# Altium project Main.PrjPcb
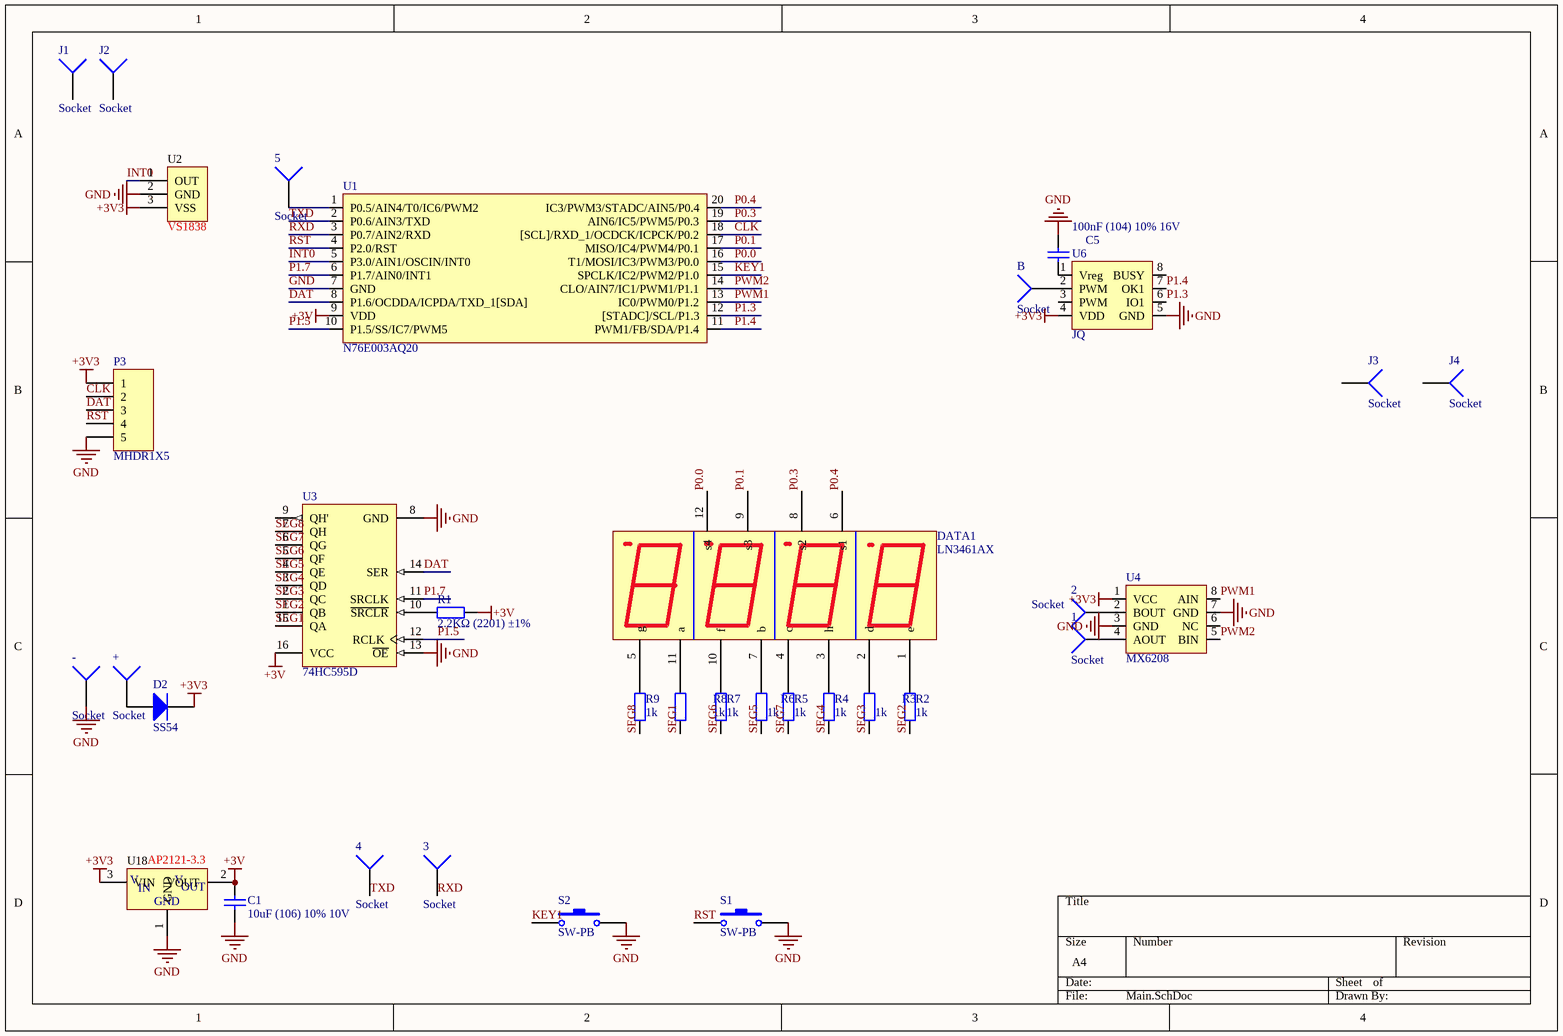
[diagram p0: Main.SchDoc]
10 sheets, 79 parts. Net scope: global (net labels, ports and power ports of the same name join across sheets).
Board file: Main.PcbDoc
Sheets:
  Main.SchDoc
  L0.SchDoc
  L1.SchDoc
  L6.SchDoc
  L4.SchDoc
  L7.SchDoc
  L3.SchDoc
  L5.SchDoc
  L2.SchDoc
  L8.SchDoc

## Sheet Main.SchDoc
size A4

### Parts
1  Socket  [MODULE-PAD$2F$3]
2  Socket  [MODULE-PAD$2F$3]
3  Socket  [MODULE-PAD$2F$3]
4  Socket  [MODULE-PAD$2F$3]
5  Socket  [MODULE-PAD$2F$3]
+  Socket  [MODULE-PAD$2F$3]
-  Socket  [MODULE-PAD$2F$3]
B  Socket  [MODULE-PAD$2F$3]
C1  10uF (106) 10% 10V  [0603_C]
C5  100nF (104) 10% 16V  [0402_C]
D2  SS54  [SMA(DO-214AC)_S1]
DATA1  LN3461AX  [DIP12:DISP2]
J1  Socket  [FPAD_1]
J2  Socket  [FPAD_1]
J3  Socket  [FPAD_1]
J4  Socket  [FPAD_1]
P3  MHDR1X5  [MHDR1X5]
R1  2.2KΩ (2201) ±1%  [0402_R]
R2  1k  [0402_R]
R3  1k  [0402_R]
R4  1k  [0402_R]
R5  1k  [0402_R]
R6  1k  [0402_R]
R7  1k  [0402_R]
R8  1k  [0402_R]
R9  1k  [0402_R]
S1  SW-PB  [SB1$2F$2]
S2  SW-PB  [SB1$2F$2]
U1  N76E003AQ20  [TSSOP20]
U2  VS1838  [LF0038Q]
U3  74HC595D  [SOIC-16_150mil]
U4  MX6208  [SOIC-8_150mil]
U6  JQ  [SOIC-8_150mil]
U18  AP2121-3.3  [SOT-23]

### Nets
+3V: C1.2 R1.2 U1.9(VDD) U3.16(VCC) U18.2(VOUT)
+3V3: D2.2(K) P3.1 U2.3(VSS) U4.1(VCC) U6.4(VDD) U18.3(VIN)
GND: -.1 C1.1 C5.2 P3.5 S1.2 S2.2 U1.7(GND) U2.2(GND) U3.8(GND) U3.13(~{OE}) U4.3(GND) U4.7(GND) U6.5(GND) U18.1(GND)
CLK: P3.2 U1.18([SCL]/RXD_1/OCDCK/ICPCK/P0.2)
DAT: P3.3 U1.8(P1.6/OCDDA/ICPDA/TXD_1[SDA]) U3.14(SER)
INT0: U1.5(P3.0/AIN1/OSCIN/INT0) U2.1(OUT)
KEY1: S2.1 U1.15(SPCLK/IC2/PWM2/P1.0)
P0.0: DATA1.12(s4) U1.16(T1/MOSI/IC3/PWM3/P0.0)
P0.1: DATA1.9(s3) U1.17(MISO/IC4/PWM4/P0.1)
P0.3: DATA1.8(s2) U1.19(AIN6/IC5/PWM5/P0.3)
P0.4: DATA1.6(s1) U1.20(IC3/PWM3/STADC/AIN5/P0.4)
P1.3: U1.12([STADC]/SCL/P1.3) U6.6(IO1)
P1.4: U1.11(PWM1/FB/SDA/P1.4) U6.7(OK1)
P1.5: U1.10(P1.5/SS/IC7/PWM5) U3.12(RCLK)
P1.7: U1.6(P1.7/AIN0/INT1) U3.11(SRCLK)
PWM1: U1.13(IC0/PWM0/P1.2) U4.8(AIN)
PWM2: U1.14(CLO/AIN7/IC1/PWM1/P1.1) U4.5(BIN)
RST: P3.4 S1.1 U1.4(P2.0/RST)
RXD: 3.1 U1.3(P0.7/AIN2/RXD)
SEG1: R8.2 U3.15(QA)
SEG2: R2.2 U3.1(QB)
SEG3: R3.2 U3.2(QC)
SEG4: R4.2 U3.3(QD)
SEG5: R6.2 U3.4(QE)
SEG6: R7.2 U3.5(QF)
SEG7: R5.2 U3.6(QG)
SEG8: R9.2 U3.7(QH)
TXD: 4.1 U1.2(P0.6/AIN3/TXD)
Net1_1: 1.1 U4.4(AOUT)
Net2_1: 2.1 U4.2(BOUT)
Net5_1: 5.1 U1.1(P0.5/AIN4/T0/IC6/PWM2)
Net+_1: +.1 D2.1(A)
NetB_1: B.1 U6.2(PWM)
NetC5_1: C5.1 U6.1(Vreg)
NetDATA1_1: DATA1.1(e) R2.1
NetDATA1_2: DATA1.2(d) R3.1
NetDATA1_3: DATA1.3(h) R4.1
NetDATA1_4: DATA1.4(c) R5.1
NetDATA1_5: DATA1.5(g) R9.1
NetDATA1_7: DATA1.7(b) R6.1
NetDATA1_10: DATA1.10(f) R7.1
NetDATA1_11: DATA1.11(a) R8.1
NetR1_1: R1.1 U3.10(~{SRCLR})

Not connected (* = marked no-connect by the designer): J1 1; J2 1; J3 1; J4 1; U3 9(QH'); U4 6(NC); U6 3(PWM) 8(BUSY)

### Notes on the sheet
- (in symbol AP2121-3) V; IN; OUT

### Library data of the parts
C1 = 0603 10uF (106) 10% 10V: 贴片电容; ComponentLink1Description: 供应商链接; ComponentLink1URL: http://www.szlcsc.com/product/details_20411.html; Package: 0603; Supplier: LC; SuppliersPartNumber: C19702
C5 = 0402 100nF (104) 10% 16V: 贴片电容; ComponentLink1Description: 供应商链接; ComponentLink1URL: http://www.szlcsc.com/product/details_1877.html; Package: 0402; Supplier: LC; SuppliersPartNumber: C1525
D2 = SMA(DO-214AC) SS54: 二极管; ComponentLink1Description: 供应商链接; ComponentLink1URL: http://www.szlcsc.com/product/details_23178.html; Package: SMA(DO-214AC); Supplier: LC; SuppliersPartNumber: C22452
DATA1 = DATA04: data?
P3 = MHDR1X5: Header, 5-Pin; LatestRevisionDate: 17-Jul-2002; LatestRevisionNote: Re-released for DXP Platform.; Publisher: Altium Limited
R1-R9 = 0402 2.2KΩ (2201) 1%: 贴片电阻; ComponentLink1Description: 供应商链接; ComponentLink1URL: http://www.szlcsc.com/product/details_26622.html; Package: 0402; Supplier: LC; SuppliersPartNumber: C25879
S1 S2 = SW-PB: Switch; Published: 24-Mar-1999; LatestRevisionDate: 17-Jul-2002; LatestRevisionNote: Re-released for DXP Platform.; PackageReference: SPST-2; Publisher: Altium Limited; PackageDescription: Switch; 2 Leads
U2 = RF: 1838 接收头 VS1838 VS1838B
U3 = 74HC595D: 74系列逻辑芯片; ComponentLink1Description: 供应商链接; ComponentLink1URL: http://www.szlcsc.com/product/details_6413.html; Package: SOIC-16_150mil; Supplier: LC; SuppliersPartNumber: C5947
U18 = AP2121-3: 3V LDO
1-5 + - B J1-J4 = Socket: LatestRevisionDate: 17-Jul-2002; LatestRevisionNote: Re-released for DXP Platform.; Publisher: Altium Limited

## Sheet L0.SchDoc
size A4
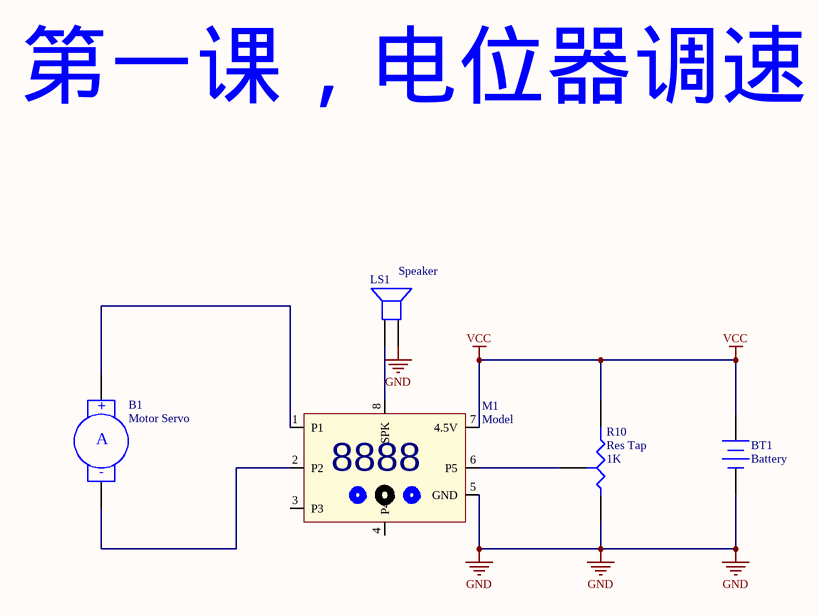
[diagram p1: L0.SchDoc]

### Parts
(Parts that share a designator on the sheet are numbered #1, #2 ... from top to bottom, then left to right.)
B1#1  Motor Servo  [RAD-0.4]
BT1#1  Battery  [BAT-2]
LS1#1  Speaker  [PIN2]
M1#1  Model
R10#1  Res Tap  value 1K  [VR3]

### Nets
GND: BT1#1.2(-) LS1#1.2 M1#1.5(GND) R10#1.1(A)
VCC: BT1#1.1(+) M1#1.7(4.5V) R10#1.2(B)
NetB1#1_1: B1#1.1(+) M1#1.1(P1)
NetB1#1_2: B1#1.2(-) M1#1.2(P2)
NetLS1#1_1: LS1#1.1 M1#1.8(SPK)
NetM1#1_6: M1#1.6(P5) R10#1.3(TAP)

Not connected (* = marked no-connect by the designer): M1#1 3(P3) 4(P4)

### Notes on the sheet
- Labels drawn without touching a wire or pin: 第一课，电位器调速
- (in symbol M?) 8888
- (in symbol Motor Servo) A

### Library data of the parts
B1#1 = Motor Servo: Servo Motor; Published: 24-Mar-1999; LatestRevisionDate: 17-Jul-2002; LatestRevisionNote: Re-released for DXP Platform.; PackageReference: RAD-0.4; Publisher: Altium Limited; PackageDescription: Radial Cap, Thru-Hole; 2 Leads; 0.4 in Pin Spacing
BT1#1 = Battery: Multicell Battery; Published: 24-Mar-1999; LatestRevisionDate: 17-Jul-2002; LatestRevisionNote: Re-released for DXP Platform.; PackageReference: BAT-2; Publisher: Altium Limited; PackageDescription: Battery; 2 Leads
LS1#1 = Speaker: Loudspeaker; Published: 24-Mar-1999; LatestRevisionDate: 17-Jul-2002; LatestRevisionNote: Re-released for DXP Platform.; PackageReference: PIN2; Publisher: Altium Limited
M1#1 = M?: 积木模块
R10#1 = Res Tap: Tapped Resistor; Sim Note: Enter the Resistance value and the set point into parameter fields.; Set Position: 0.5; Published: 24-Mar-1999; LatestRevisionDate: 17-Jul-2002; LatestRevisionNote: Re-released for DXP Platform.; PackageReference: VR3; Publisher: Altium Limited; PackageDescription: Variable Resistor, Thru-Hole; 3 Leads

## Sheet L1.SchDoc
size A4
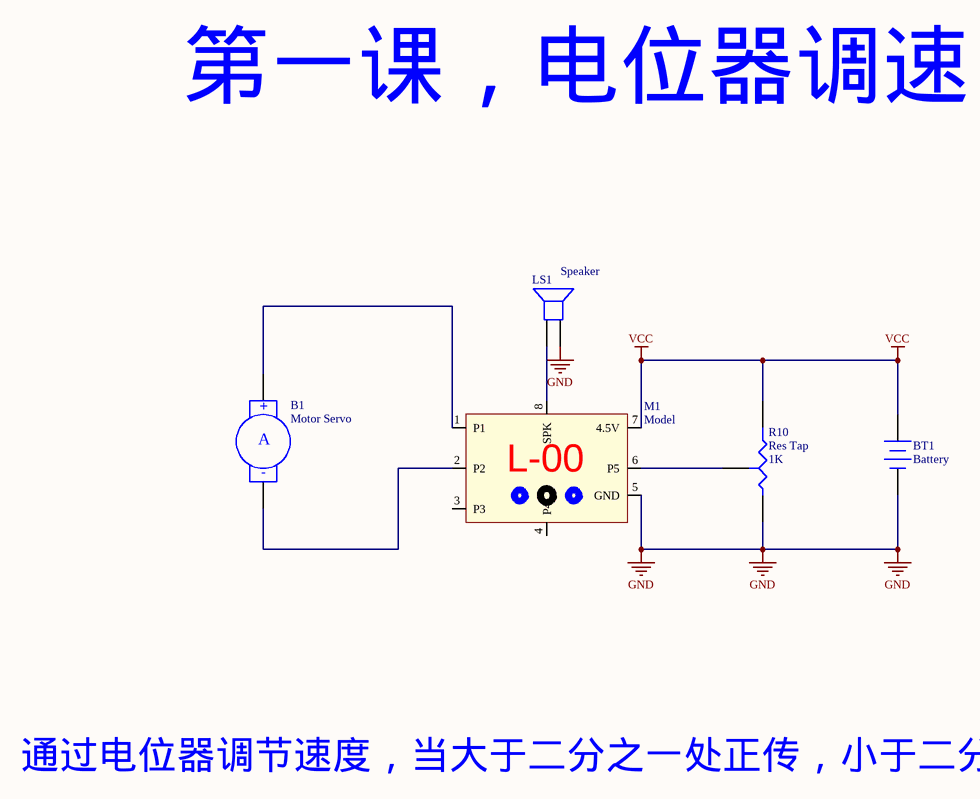
[diagram p2: L1.SchDoc]

### Parts
(Parts that share a designator on the sheet are numbered #1, #2 ... from top to bottom, then left to right.)
B1#2  Motor Servo  [RAD-0.4]
BT1#2  Battery  [BAT-2]
LS1#2  Speaker  [PIN2]
M1#2  Model
R10#2  Res Tap  value 1K  [VR3]

### Nets
GND: BT1#2.2(-) LS1#2.2 M1#2.5(GND) R10#2.1(A)
VCC: BT1#2.1(+) M1#2.7(4.5V) R10#2.2(B)
NetB1#2_1: B1#2.1(+) M1#2.1(P1)
NetB1#2_2: B1#2.2(-) M1#2.2(P2)
NetLS1#2_1: LS1#2.1 M1#2.8(SPK)
NetM1#2_6: M1#2.6(P5) R10#2.3(TAP)

Not connected (* = marked no-connect by the designer): M1#2 3(P3) 4(P4)

### Notes on the sheet
- Labels drawn without touching a wire or pin: L-00, 第一课，电位器调速, 通过电位器调节速度，当大于二分之一处正传，小于二分之一处反转
- (in symbol Motor Servo) A

### Library data of the parts
B1#2 = Motor Servo: Servo Motor; Published: 24-Mar-1999; LatestRevisionDate: 17-Jul-2002; LatestRevisionNote: Re-released for DXP Platform.; PackageReference: RAD-0.4; Publisher: Altium Limited; PackageDescription: Radial Cap, Thru-Hole; 2 Leads; 0.4 in Pin Spacing
BT1#2 = Battery: Multicell Battery; Published: 24-Mar-1999; LatestRevisionDate: 17-Jul-2002; LatestRevisionNote: Re-released for DXP Platform.; PackageReference: BAT-2; Publisher: Altium Limited; PackageDescription: Battery; 2 Leads
LS1#2 = Speaker: Loudspeaker; Published: 24-Mar-1999; LatestRevisionDate: 17-Jul-2002; LatestRevisionNote: Re-released for DXP Platform.; PackageReference: PIN2; Publisher: Altium Limited
M1#2 = M?: 积木模块
R10#2 = Res Tap: as R10#1 on sheet L0; Published: 24-Mar-1999; LatestRevisionDate: 17-Jul-2002; LatestRevisionNote: Re-released for DXP Platform.; PackageReference: VR3; Publisher: Altium Limited; PackageDescription: Variable Resistor, Thru-Hole; 3 Leads

## Sheet L6.SchDoc
size A4
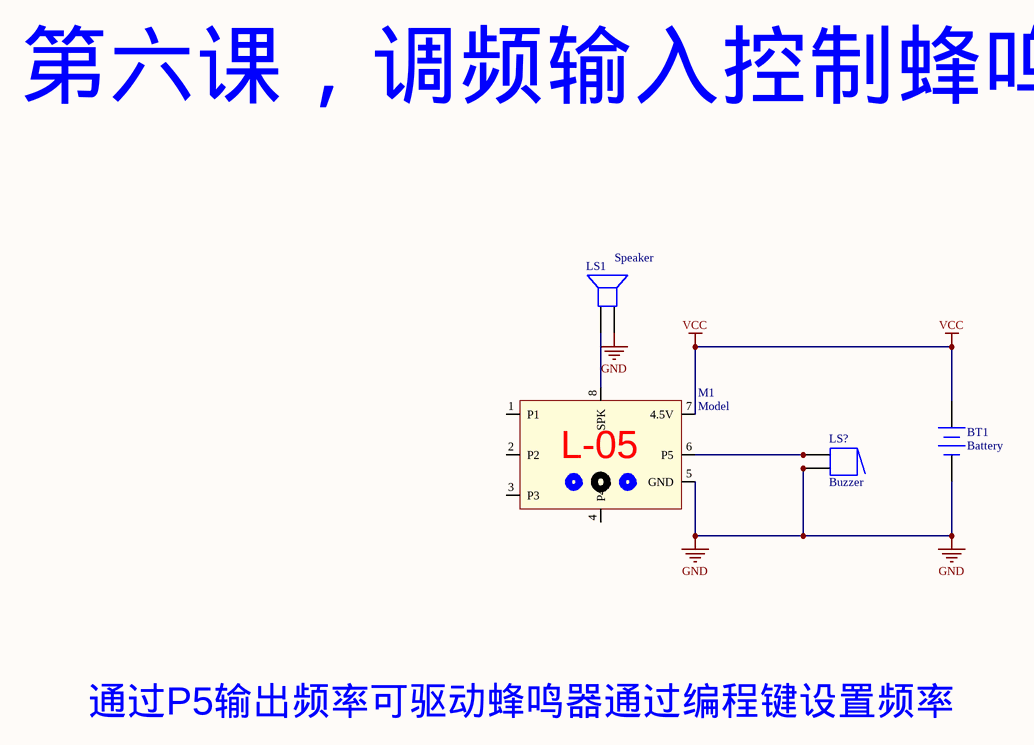
[diagram p3: L6.SchDoc]

### Parts
(Parts that share a designator on the sheet are numbered #1, #2 ... from top to bottom, then left to right.)
BT1#3  Battery  [BAT-2]
LS1#3  Speaker  [PIN2]
LS?  Buzzer  [ABSM-1574]
M1#3  Model

### Nets
GND: BT1#3.2(-) LS1#3.2 LS?.2 LS?.2A M1#3.5(GND)
VCC: BT1#3.1(+) M1#3.7(4.5V)
NetLS1#3_1: LS1#3.1 M1#3.8(SPK)
NetLS?_1: LS?.1 LS?.1A M1#3.6(P5)

Not connected (* = marked no-connect by the designer): M1#3 1(P1) 2(P2) 3(P3) 4(P4)

### Notes on the sheet
- Labels drawn without touching a wire or pin: L-05, 第六课，调频输入控制蜂鸣器, 通过P5输出频率可驱动蜂鸣器通过编程键设置频率

### Library data of the parts
BT1#3 = Battery: Multicell Battery; Published: 24-Mar-1999; LatestRevisionDate: 17-Jul-2002; LatestRevisionNote: Re-released for DXP Platform.; PackageReference: BAT-2; Publisher: Altium Limited; PackageDescription: Battery; 2 Leads
LS1#3 = Speaker: Loudspeaker; Published: 24-Mar-1999; LatestRevisionDate: 17-Jul-2002; LatestRevisionNote: Re-released for DXP Platform.; PackageReference: PIN2; Publisher: Altium Limited
LS? = Buzzer: Magnetic Transducer Buzzer; Published: 24-Mar-1999; LatestRevisionDate: 17-Dec-2003; LatestRevisionNote: Schematic revised, PCB Footprint replaced.; DatasheetVersion: 17-Dec-2003; PackageReference: ABSM-1574; Publisher: Altium Limited; PackageDescription: Magnetic Transducer Buzzer; ComponentLink1Description: Manufacturer Link; ComponentLink1URL: http://www.megastar.com/linecard/buzzmode/index.php
M1#3 = M?: 积木模块

## Sheet L4.SchDoc
size A4
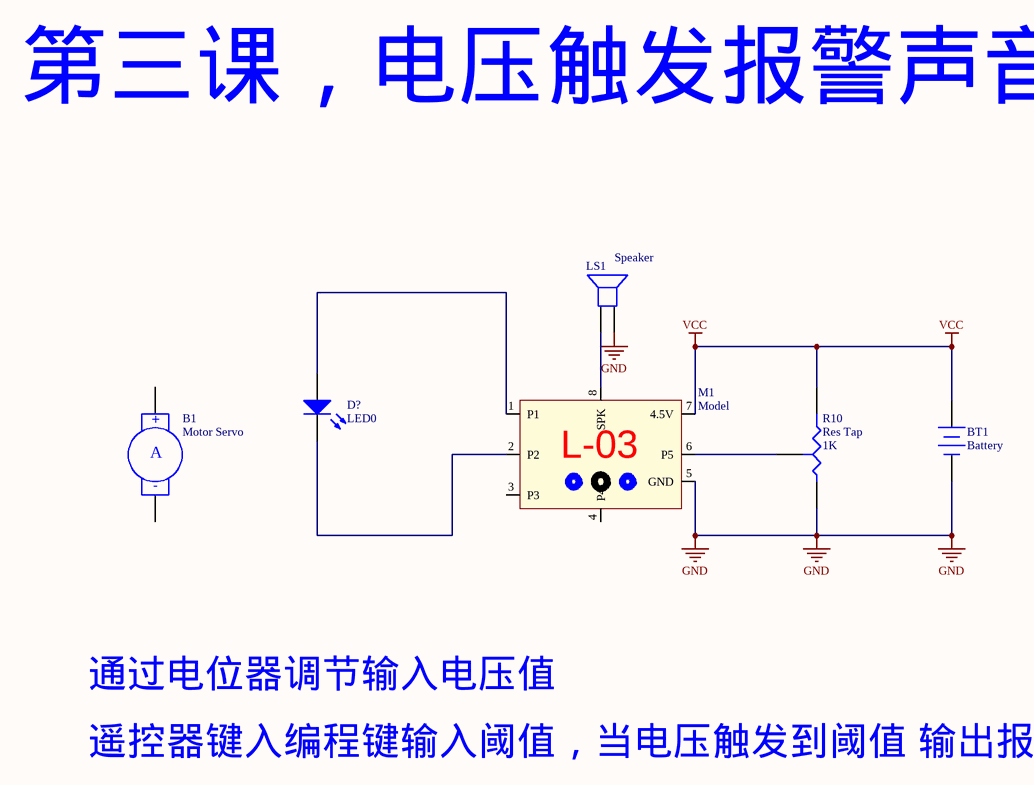
[diagram p4: L4.SchDoc]

### Parts
(Parts that share a designator on the sheet are numbered #1, #2 ... from top to bottom, then left to right.)
B1#3  Motor Servo  [RAD-0.4]
BT1#4  Battery  [BAT-2]
D?#1  LED0  [LED-0]
LS1#4  Speaker  [PIN2]
M1#4  Model
R10#3  Res Tap  value 1K  [VR3]

### Nets
GND: BT1#4.2(-) LS1#4.2 M1#4.5(GND) R10#3.1(A)
VCC: BT1#4.1(+) M1#4.7(4.5V) R10#3.2(B)
NetD?#1_1: D?#1.1(A) M1#4.1(P1)
NetD?#1_2: D?#1.2(K) M1#4.2(P2)
NetLS1#4_1: LS1#4.1 M1#4.8(SPK)
NetM1#4_6: M1#4.6(P5) R10#3.3(TAP)

Not connected (* = marked no-connect by the designer): B1#3 1(+) 2(-); M1#4 3(P3) 4(P4)

### Notes on the sheet
- Labels drawn without touching a wire or pin: L-03, 第三课，电压触发报警声音输出, 通过电位器调节输入电压值, 遥控器键入编程键输入阈值，当电压触发到阈值 输出报警声音
- (in symbol Motor Servo) A

### Library data of the parts
B1#3 = Motor Servo: Servo Motor; Published: 24-Mar-1999; LatestRevisionDate: 17-Jul-2002; LatestRevisionNote: Re-released for DXP Platform.; PackageReference: RAD-0.4; Publisher: Altium Limited; PackageDescription: Radial Cap, Thru-Hole; 2 Leads; 0.4 in Pin Spacing
BT1#4 = Battery: Multicell Battery; Published: 24-Mar-1999; LatestRevisionDate: 17-Jul-2002; LatestRevisionNote: Re-released for DXP Platform.; PackageReference: BAT-2; Publisher: Altium Limited; PackageDescription: Battery; 2 Leads
D?#1 = LED0: Typical INFRARED GaAs LED; Published: 8-Jun-2000; LatestRevisionDate: 08-Jul-2005; LatestRevisionNote: Mech Layer 1 removed.; PackageReference: LED-0; Publisher: Altium Limited; PackageDescription: LED; 2 Leads
LS1#4 = Speaker: Loudspeaker; Published: 24-Mar-1999; LatestRevisionDate: 17-Jul-2002; LatestRevisionNote: Re-released for DXP Platform.; PackageReference: PIN2; Publisher: Altium Limited
M1#4 = M?: 积木模块
R10#3 = Res Tap: as R10#1 on sheet L0; Published: 24-Mar-1999; LatestRevisionDate: 17-Jul-2002; LatestRevisionNote: Re-released for DXP Platform.; PackageReference: VR3; Publisher: Altium Limited; PackageDescription: Variable Resistor, Thru-Hole; 3 Leads

## Sheet L7.SchDoc
size A4
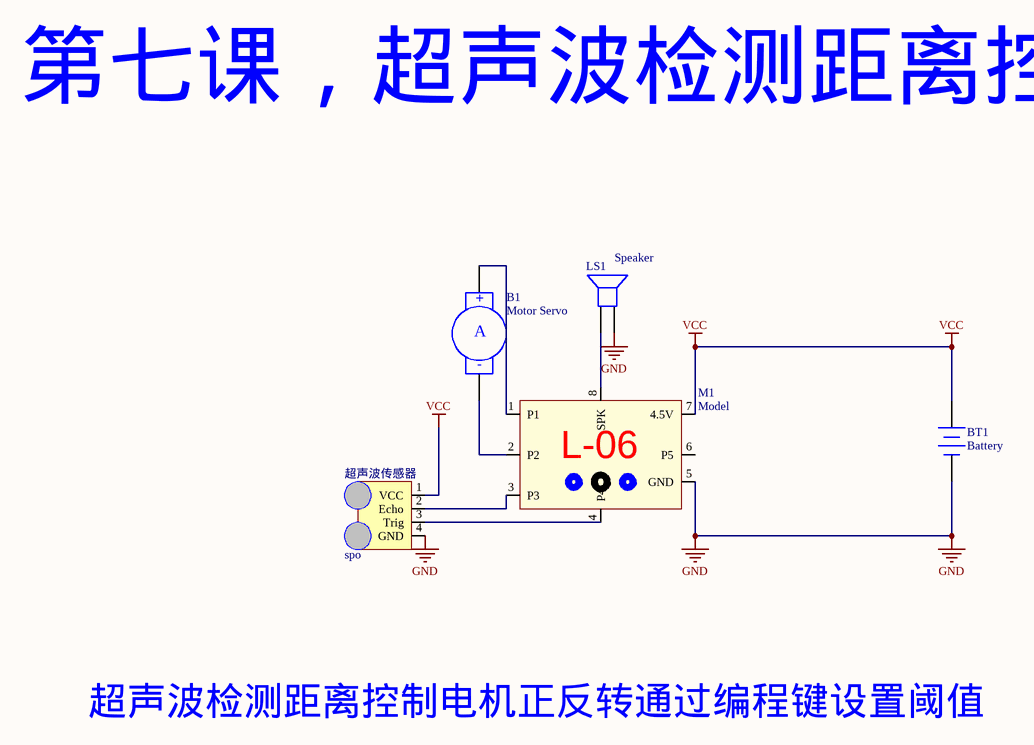
[diagram p5: L7.SchDoc]

### Parts
(Parts that share a designator on the sheet are numbered #1, #2 ... from top to bottom, then left to right.)
B1#4  Motor Servo  [RAD-0.4]
BT1#5  Battery  [BAT-2]
LS1#5  Speaker  [PIN2]
M1#5  Model
超声波传感器#1  spo

### Nets
GND: BT1#5.2(-) LS1#5.2 M1#5.5(GND) 超声波传感器#1.4(GND)
VCC: BT1#5.1(+) M1#5.7(4.5V) 超声波传感器#1.1(VCC)
NetB1#4_1: B1#4.1(+) M1#5.1(P1)
NetB1#4_2: B1#4.2(-) M1#5.2(P2)
NetLS1#5_1: LS1#5.1 M1#5.8(SPK)
NetM1#5_3: M1#5.3(P3) 超声波传感器#1.2(Echo)
NetM1#5_4: M1#5.4(P4) 超声波传感器#1.3(Trig)

Not connected (* = marked no-connect by the designer): M1#5 6(P5)

### Notes on the sheet
- Labels drawn without touching a wire or pin: L-06, 第七课，超声波检测距离控制电机, 超声波检测距离控制电机正反转通过编程键设置阈值
- (in symbol Motor Servo) A

### Library data of the parts
B1#4 = Motor Servo: Servo Motor; Published: 24-Mar-1999; LatestRevisionDate: 17-Jul-2002; LatestRevisionNote: Re-released for DXP Platform.; PackageReference: RAD-0.4; Publisher: Altium Limited; PackageDescription: Radial Cap, Thru-Hole; 2 Leads; 0.4 in Pin Spacing
BT1#5 = Battery: Multicell Battery; Published: 24-Mar-1999; LatestRevisionDate: 17-Jul-2002; LatestRevisionNote: Re-released for DXP Platform.; PackageReference: BAT-2; Publisher: Altium Limited; PackageDescription: Battery; 2 Leads
LS1#5 = Speaker: Loudspeaker; Published: 24-Mar-1999; LatestRevisionDate: 17-Jul-2002; LatestRevisionNote: Re-released for DXP Platform.; PackageReference: PIN2; Publisher: Altium Limited
M1#5 = M?: 积木模块

## Sheet L3.SchDoc
size A4
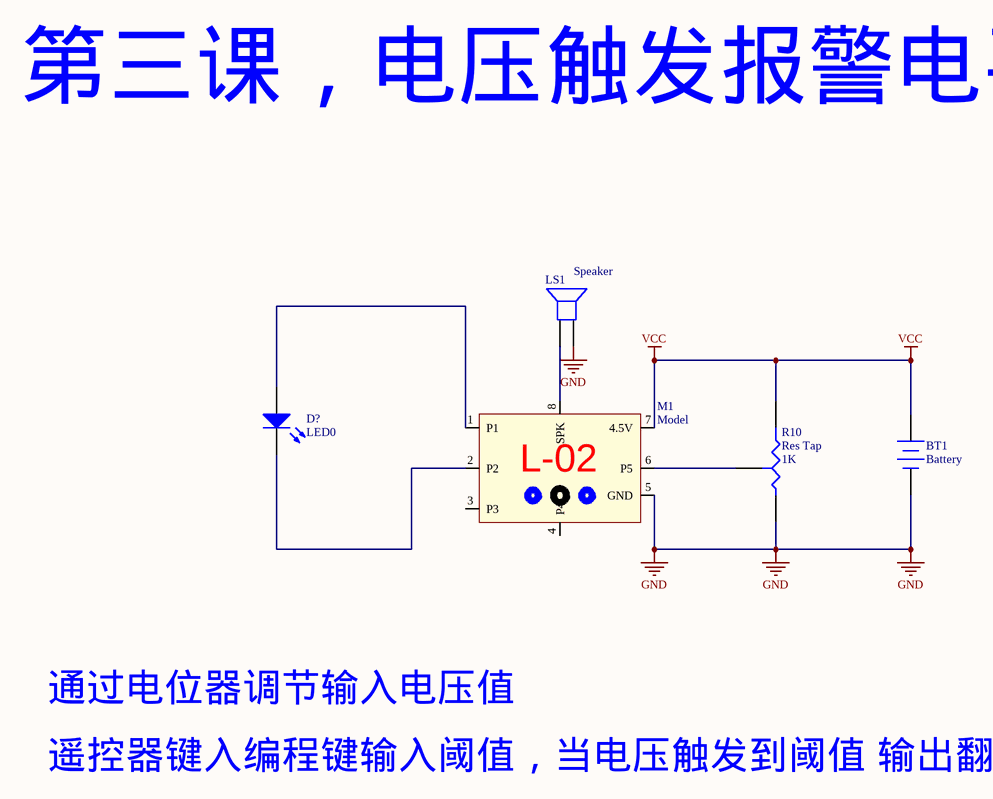
[diagram p6: L3.SchDoc]

### Parts
(Parts that share a designator on the sheet are numbered #1, #2 ... from top to bottom, then left to right.)
BT1#6  Battery  [BAT-2]
D?#2  LED0  [LED-0]
LS1#6  Speaker  [PIN2]
M1#6  Model
R10#4  Res Tap  value 1K  [VR3]

### Nets
GND: BT1#6.2(-) LS1#6.2 M1#6.5(GND) R10#4.1(A)
VCC: BT1#6.1(+) M1#6.7(4.5V) R10#4.2(B)
NetD?#2_1: D?#2.1(A) M1#6.1(P1)
NetD?#2_2: D?#2.2(K) M1#6.2(P2)
NetLS1#6_1: LS1#6.1 M1#6.8(SPK)
NetM1#6_6: M1#6.6(P5) R10#4.3(TAP)

Not connected (* = marked no-connect by the designer): M1#6 3(P3) 4(P4)

### Notes on the sheet
- Labels drawn without touching a wire or pin: L-02, 第三课，电压触发报警电平输出, 通过电位器调节输入电压值, 遥控器键入编程键输入阈值，当电压触发到阈值 输出翻转灯点亮

### Library data of the parts
BT1#6 = Battery: Multicell Battery; Published: 24-Mar-1999; LatestRevisionDate: 17-Jul-2002; LatestRevisionNote: Re-released for DXP Platform.; PackageReference: BAT-2; Publisher: Altium Limited; PackageDescription: Battery; 2 Leads
D?#2 = LED0: Typical INFRARED GaAs LED; Published: 8-Jun-2000; LatestRevisionDate: 08-Jul-2005; LatestRevisionNote: Mech Layer 1 removed.; PackageReference: LED-0; Publisher: Altium Limited; PackageDescription: LED; 2 Leads
LS1#6 = Speaker: Loudspeaker; Published: 24-Mar-1999; LatestRevisionDate: 17-Jul-2002; LatestRevisionNote: Re-released for DXP Platform.; PackageReference: PIN2; Publisher: Altium Limited
M1#6 = M?: 积木模块
R10#4 = Res Tap: as R10#1 on sheet L0; Published: 24-Mar-1999; LatestRevisionDate: 17-Jul-2002; LatestRevisionNote: Re-released for DXP Platform.; PackageReference: VR3; Publisher: Altium Limited; PackageDescription: Variable Resistor, Thru-Hole; 3 Leads

## Sheet L5.SchDoc
size A4
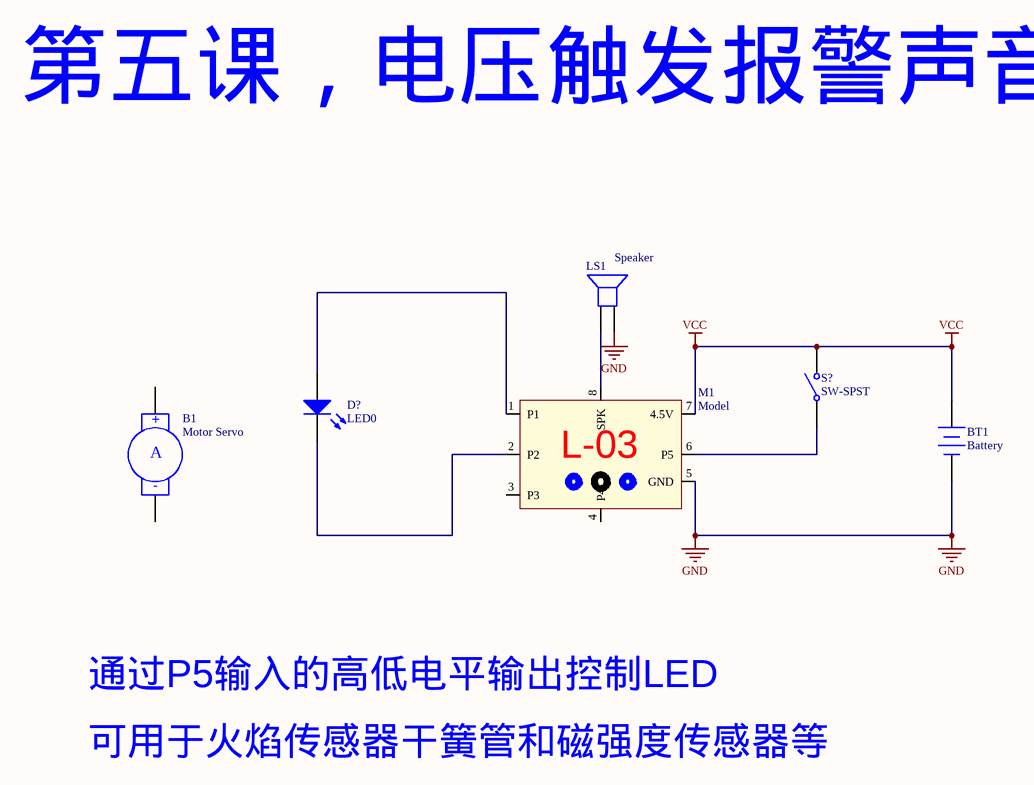
[diagram p7: L5.SchDoc]

### Parts
(Parts that share a designator on the sheet are numbered #1, #2 ... from top to bottom, then left to right.)
B1#5  Motor Servo  [RAD-0.4]
BT1#7  Battery  [BAT-2]
D?#3  LED0  [LED-0]
LS1#7  Speaker  [PIN2]
M1#7  Model
S?  SW-SPST  [SPST-2]

### Nets
GND: BT1#7.2(-) LS1#7.2 M1#7.5(GND)
VCC: BT1#7.1(+) M1#7.7(4.5V) S?.2(NO)
NetD?#3_1: D?#3.1(A) M1#7.1(P1)
NetD?#3_2: D?#3.2(K) M1#7.2(P2)
NetLS1#7_1: LS1#7.1 M1#7.8(SPK)
NetM1#7_6: M1#7.6(P5) S?.1(COMMON)

Not connected (* = marked no-connect by the designer): B1#5 1(+) 2(-); M1#7 3(P3) 4(P4)

### Notes on the sheet
- Labels drawn without touching a wire or pin: L-03, 可用于火焰传感器干簧管和磁强度传感器等, 第五课，电压触发报警声音输出, 通过P5输入的高低电平输出控制LED
- (in symbol Motor Servo) A

### Library data of the parts
B1#5 = Motor Servo: Servo Motor; Published: 24-Mar-1999; LatestRevisionDate: 17-Jul-2002; LatestRevisionNote: Re-released for DXP Platform.; PackageReference: RAD-0.4; Publisher: Altium Limited; PackageDescription: Radial Cap, Thru-Hole; 2 Leads; 0.4 in Pin Spacing
BT1#7 = Battery: Multicell Battery; Published: 24-Mar-1999; LatestRevisionDate: 17-Jul-2002; LatestRevisionNote: Re-released for DXP Platform.; PackageReference: BAT-2; Publisher: Altium Limited; PackageDescription: Battery; 2 Leads
D?#3 = LED0: Typical INFRARED GaAs LED; Published: 8-Jun-2000; LatestRevisionDate: 08-Jul-2005; LatestRevisionNote: Mech Layer 1 removed.; PackageReference: LED-0; Publisher: Altium Limited; PackageDescription: LED; 2 Leads
LS1#7 = Speaker: Loudspeaker; Published: 24-Mar-1999; LatestRevisionDate: 17-Jul-2002; LatestRevisionNote: Re-released for DXP Platform.; PackageReference: PIN2; Publisher: Altium Limited
M1#7 = M?: 积木模块
S? = SW-SPST: Single-Pole, Single-Throw Switch; Published: 24-Mar-1999; LatestRevisionDate: 17-Jul-2002; LatestRevisionNote: Re-released for DXP Platform.; PackageReference: SPST-2; Publisher: Altium Limited; PackageDescription: Switch; 2 Leads

## Sheet L2.SchDoc
size A4
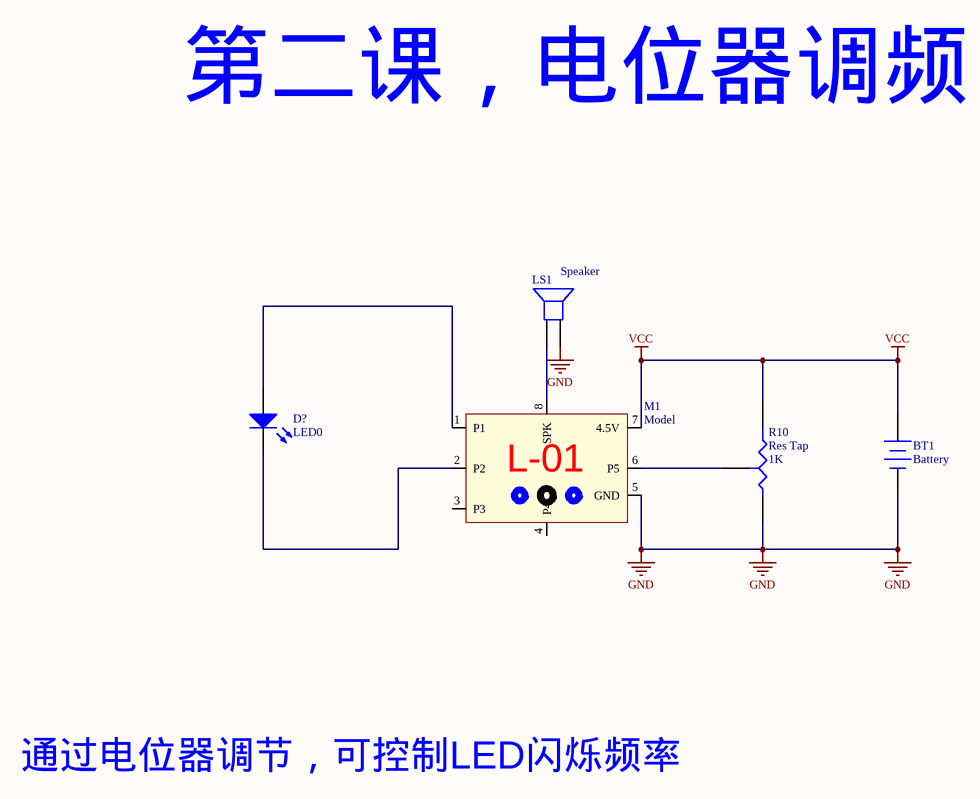
[diagram p8: L2.SchDoc]

### Parts
(Parts that share a designator on the sheet are numbered #1, #2 ... from top to bottom, then left to right.)
BT1#8  Battery  [BAT-2]
D?#4  LED0  [LED-0]
LS1#8  Speaker  [PIN2]
M1#8  Model
R10#5  Res Tap  value 1K  [VR3]

### Nets
GND: BT1#8.2(-) LS1#8.2 M1#8.5(GND) R10#5.1(A)
VCC: BT1#8.1(+) M1#8.7(4.5V) R10#5.2(B)
NetD?#4_1: D?#4.1(A) M1#8.1(P1)
NetD?#4_2: D?#4.2(K) M1#8.2(P2)
NetLS1#8_1: LS1#8.1 M1#8.8(SPK)
NetM1#8_6: M1#8.6(P5) R10#5.3(TAP)

Not connected (* = marked no-connect by the designer): M1#8 3(P3) 4(P4)

### Notes on the sheet
- Labels drawn without touching a wire or pin: L-01, 第二课，电位器调频, 通过电位器调节，可控制LED闪烁频率

### Library data of the parts
BT1#8 = Battery: Multicell Battery; Published: 24-Mar-1999; LatestRevisionDate: 17-Jul-2002; LatestRevisionNote: Re-released for DXP Platform.; PackageReference: BAT-2; Publisher: Altium Limited; PackageDescription: Battery; 2 Leads
D?#4 = LED0: Typical INFRARED GaAs LED; Published: 8-Jun-2000; LatestRevisionDate: 08-Jul-2005; LatestRevisionNote: Mech Layer 1 removed.; PackageReference: LED-0; Publisher: Altium Limited; PackageDescription: LED; 2 Leads
LS1#8 = Speaker: Loudspeaker; Published: 24-Mar-1999; LatestRevisionDate: 17-Jul-2002; LatestRevisionNote: Re-released for DXP Platform.; PackageReference: PIN2; Publisher: Altium Limited
M1#8 = M?: 积木模块
R10#5 = Res Tap: as R10#1 on sheet L0; Published: 24-Mar-1999; LatestRevisionDate: 17-Jul-2002; LatestRevisionNote: Re-released for DXP Platform.; PackageReference: VR3; Publisher: Altium Limited; PackageDescription: Variable Resistor, Thru-Hole; 3 Leads

## Sheet L8.SchDoc
size A4
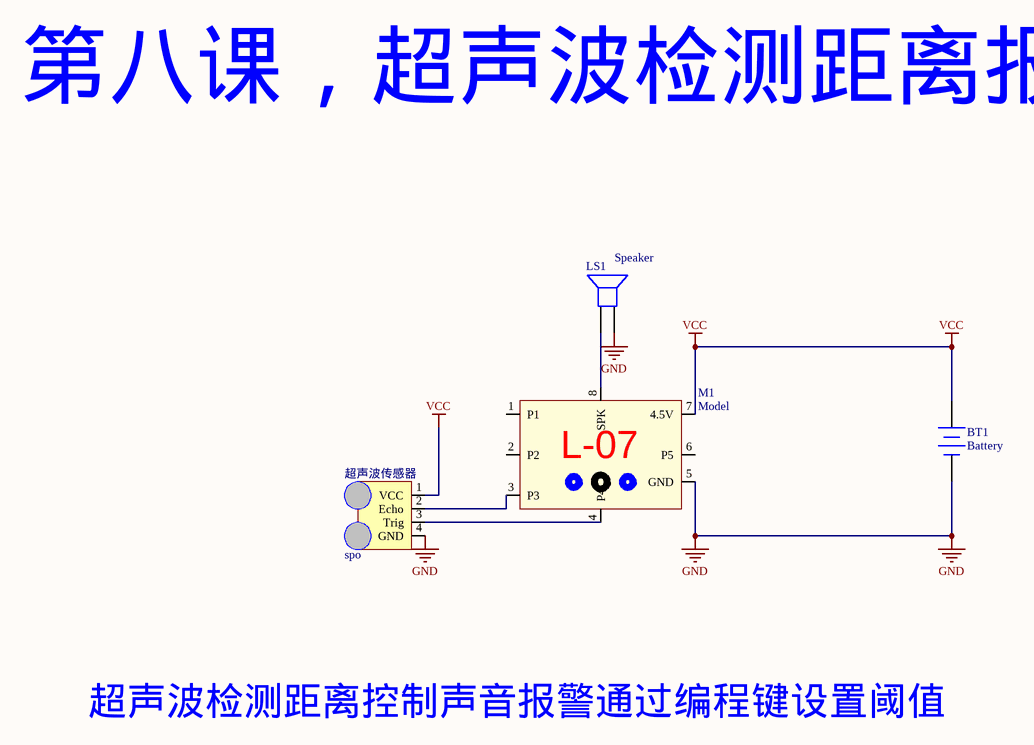
[diagram p9: L8.SchDoc]

### Parts
(Parts that share a designator on the sheet are numbered #1, #2 ... from top to bottom, then left to right.)
BT1#9  Battery  [BAT-2]
LS1#9  Speaker  [PIN2]
M1#9  Model
超声波传感器#2  spo

### Nets
GND: BT1#9.2(-) LS1#9.2 M1#9.5(GND) 超声波传感器#2.4(GND)
VCC: BT1#9.1(+) M1#9.7(4.5V) 超声波传感器#2.1(VCC)
NetLS1#9_1: LS1#9.1 M1#9.8(SPK)
NetM1#9_3: M1#9.3(P3) 超声波传感器#2.2(Echo)
NetM1#9_4: M1#9.4(P4) 超声波传感器#2.3(Trig)

Not connected (* = marked no-connect by the designer): M1#9 1(P1) 2(P2) 6(P5)

### Notes on the sheet
- Labels drawn without touching a wire or pin: L-07, 第八课，超声波检测距离报警, 超声波检测距离控制声音报警通过编程键设置阈值

### Library data of the parts
BT1#9 = Battery: Multicell Battery; Published: 24-Mar-1999; LatestRevisionDate: 17-Jul-2002; LatestRevisionNote: Re-released for DXP Platform.; PackageReference: BAT-2; Publisher: Altium Limited; PackageDescription: Battery; 2 Leads
LS1#9 = Speaker: Loudspeaker; Published: 24-Mar-1999; LatestRevisionDate: 17-Jul-2002; LatestRevisionNote: Re-released for DXP Platform.; PackageReference: PIN2; Publisher: Altium Limited
M1#9 = M?: 积木模块

## Nets that join several sheets
GND: Main (14 pins), L0 (BT1#1.2 LS1#1.2 M1#1.5 R10#1.1), L1 (BT1#2.2 LS1#2.2 M1#2.5 R10#2.1), L6 (5 pins), L4 (BT1#4.2 LS1#4.2 M1#4.5 R10#3.1), L7 (BT1#5.2 LS1#5.2 M1#5.5 超声波传感器#1.4), L3 (BT1#6.2 LS1#6.2 M1#6.5 R10#4.1), L5 (BT1#7.2 LS1#7.2 M1#7.5), L2 (BT1#8.2 LS1#8.2 M1#8.5 R10#5.1), L8 (BT1#9.2 LS1#9.2 M1#9.5 超声波传感器#2.4)
VCC: L0 (BT1#1.1 M1#1.7 R10#1.2), L1 (BT1#2.1 M1#2.7 R10#2.2), L6 (BT1#3.1 M1#3.7), L4 (BT1#4.1 M1#4.7 R10#3.2), L7 (BT1#5.1 M1#5.7 超声波传感器#1.1), L3 (BT1#6.1 M1#6.7 R10#4.2), L5 (BT1#7.1 M1#7.7 S?.2), L2 (BT1#8.1 M1#8.7 R10#5.2), L8 (BT1#9.1 M1#9.7 超声波传感器#2.1)